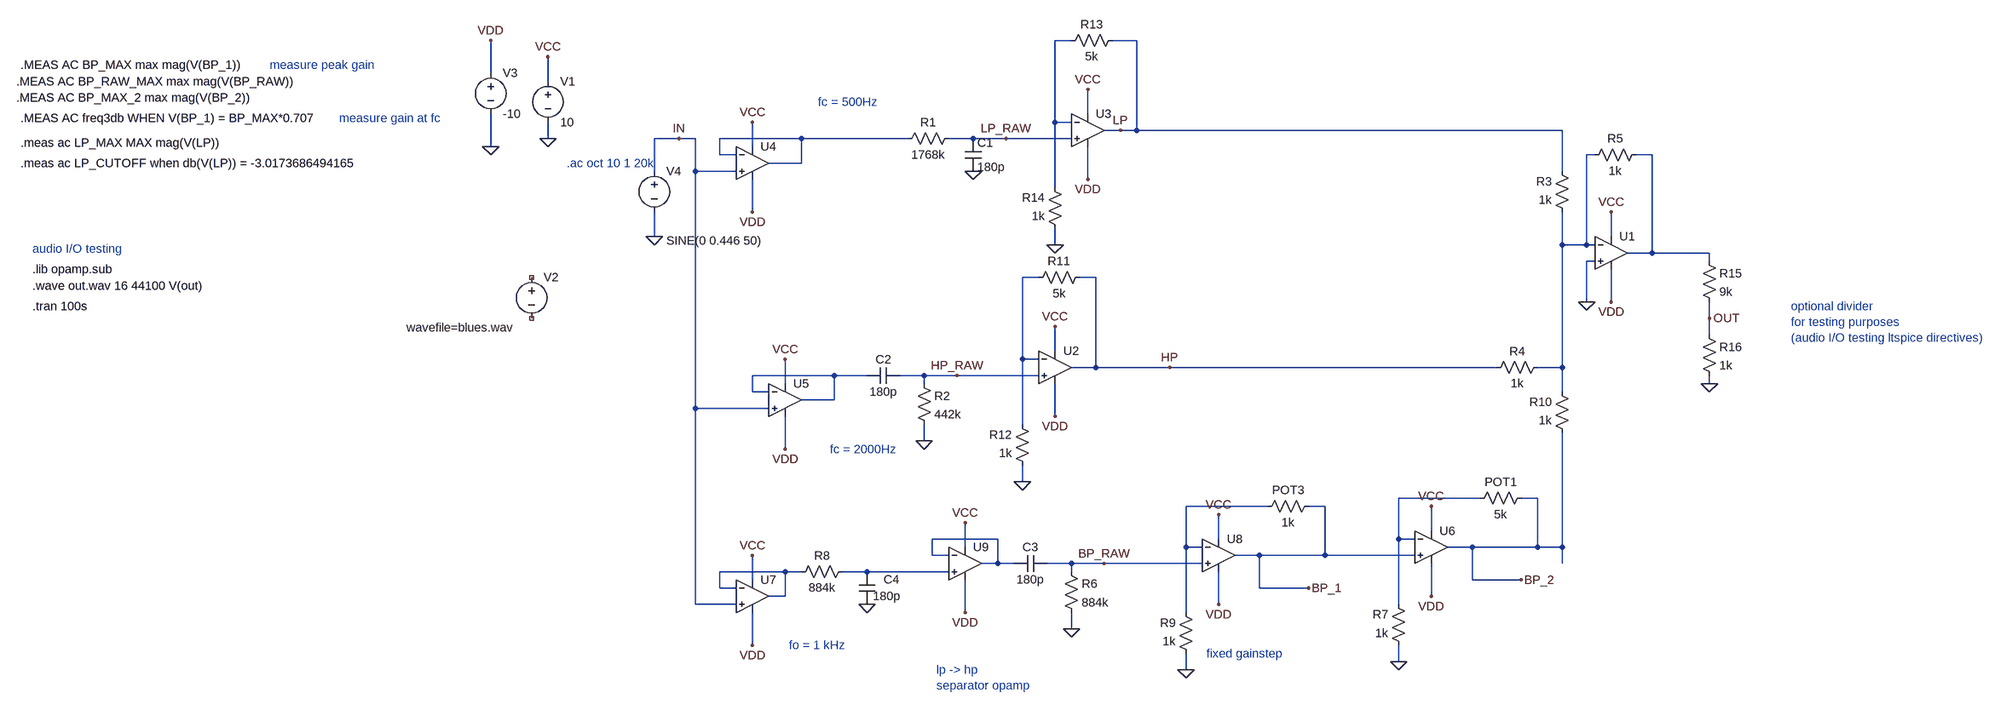
[diagram p0: schematic Draft2.asc]
Draft2.asc, the LTspice schematic file:
Version 4.1
SHEET 1 1964 1344
WIRE 128 -256 96 -256
WIRE 256 -256 208 -256
WIRE -1008 -192 -1008 -256
WIRE -896 -176 -896 -224
WIRE 160 -112 160 -160
WIRE 96 -96 96 -256
WIRE 128 -96 96 -96
WIRE 224 -80 192 -80
WIRE 256 -80 256 -256
WIRE 256 -80 224 -80
WIRE 1088 -80 256 -80
WIRE -896 -64 -896 -96
WIRE -640 -64 -688 -64
WIRE -608 -64 -640 -64
WIRE -400 -64 -560 -64
WIRE -192 -64 -400 -64
WIRE -64 -64 -112 -64
WIRE 0 -64 -64 -64
WIRE 128 -64 0 -64
WIRE -1008 -48 -1008 -112
WIRE -496 -48 -496 -96
WIRE -560 -32 -560 -64
WIRE -528 -32 -560 -32
WIRE 1152 -32 1136 -32
WIRE 1264 -32 1232 -32
WIRE -400 -16 -400 -64
WIRE -400 -16 -464 -16
WIRE -688 0 -688 -64
WIRE -608 0 -608 -64
WIRE -528 0 -608 0
WIRE 1088 0 1088 -80
WIRE 160 16 160 -48
WIRE 96 32 96 -96
WIRE -496 80 -496 16
WIRE -688 128 -688 80
WIRE 1184 128 1184 80
WIRE 96 144 96 112
WIRE 1088 144 1088 80
WIRE 1136 144 1136 -32
WIRE 1136 144 1088 144
WIRE 1152 144 1136 144
WIRE 1264 160 1264 -32
WIRE 1264 160 1216 160
WIRE 1376 160 1264 160
WIRE 1152 176 1136 176
WIRE 1376 176 1376 160
WIRE 64 208 32 208
WIRE 176 208 144 208
WIRE 1136 256 1136 176
WIRE 1184 256 1184 192
WIRE 1376 288 1376 256
WIRE 1376 320 1376 288
WIRE 96 352 96 304
WIRE 32 368 32 208
WIRE 64 368 32 368
WIRE 176 384 176 208
WIRE 176 384 128 384
WIRE 320 384 176 384
WIRE 960 384 320 384
WIRE 1088 384 1088 144
WIRE 1088 384 1040 384
WIRE -336 400 -496 400
WIRE -272 400 -336 400
WIRE -160 400 -208 400
WIRE -96 400 -160 400
WIRE 64 400 -96 400
WIRE -432 416 -432 368
WIRE -160 416 -160 400
WIRE 1376 416 1376 400
WIRE -496 432 -496 400
WIRE -464 432 -496 432
WIRE 1088 432 1088 384
WIRE -336 448 -336 400
WIRE -336 448 -400 448
WIRE -608 464 -608 0
WIRE -464 464 -608 464
WIRE 96 480 96 416
WIRE 32 496 32 368
WIRE -160 528 -160 496
WIRE -432 544 -432 480
WIRE 32 608 32 576
WIRE 928 640 768 640
WIRE 1040 640 1008 640
WIRE 512 656 352 656
WIRE 624 656 592 656
WIRE 832 704 832 656
WIRE -16 720 -144 720
WIRE 416 720 416 672
WIRE 768 720 768 640
WIRE 800 720 768 720
WIRE -80 736 -80 688
WIRE 352 736 352 656
WIRE 384 736 352 736
WIRE 912 736 864 736
WIRE 1040 736 1040 640
WIRE 1040 736 912 736
WIRE 1088 736 1088 512
WIRE 1088 736 1040 736
WIRE -144 752 -144 720
WIRE -112 752 -144 752
WIRE 496 752 448 752
WIRE 624 752 624 656
WIRE 624 752 496 752
WIRE 800 752 624 752
WIRE -16 768 -16 720
WIRE -16 768 -48 768
WIRE 16 768 -16 768
WIRE 128 768 80 768
WIRE 192 768 128 768
WIRE 384 768 192 768
WIRE 1088 768 1088 736
WIRE -432 784 -560 784
WIRE -400 784 -432 784
WIRE -272 784 -320 784
WIRE -112 784 -272 784
WIRE 128 784 128 768
WIRE -496 800 -496 752
WIRE 912 800 912 736
WIRE 1008 800 912 800
WIRE -560 816 -560 784
WIRE -528 816 -560 816
WIRE 496 816 496 752
WIRE 592 816 496 816
WIRE -432 832 -432 784
WIRE -432 832 -464 832
WIRE 832 832 832 768
WIRE -608 848 -608 464
WIRE -528 848 -608 848
WIRE 416 848 416 784
WIRE 768 848 768 720
WIRE -80 864 -80 800
WIRE 352 864 352 736
WIRE 128 896 128 864
WIRE -496 928 -496 864
WIRE 768 960 768 928
WIRE 352 976 352 944
FLAG -160 528 0
FLAG 1136 256 0
FLAG -64 0 0
FLAG -688 128 0
FLAG -896 -64 0
FLAG -896 -224 VCC
FLAG 1184 80 VCC
FLAG -1008 -256 VDD
FLAG -1008 -48 0
FLAG 1184 256 VDD
FLAG 1376 288 OUT
FLAG -640 -64 IN
FLAG -496 -96 VCC
FLAG -496 80 VDD
FLAG -432 368 VCC
FLAG -432 544 VDD
FLAG 128 896 0
FLAG -496 752 VCC
FLAG -496 928 VDD
FLAG -272 848 0
FLAG 592 816 BP_1
FLAG 0 -64 LP_RAW
FLAG -96 400 HP_RAW
FLAG 416 672 VCC
FLAG 416 848 VDD
FLAG 352 976 0
FLAG 192 768 BP_RAW
FLAG -80 688 VCC
FLAG -80 864 VDD
FLAG 96 304 VCC
FLAG 96 480 VDD
FLAG 32 608 0
FLAG 160 -160 VCC
FLAG 160 16 VDD
FLAG 96 144 0
FLAG 224 -80 LP
FLAG 1008 800 BP_2
FLAG 832 656 VCC
FLAG 832 832 VDD
FLAG 768 960 0
FLAG 1376 416 0
FLAG 320 384 HP
SYMBOL OpAmps\\UniversalOpAmp 1184 160 R0
SYMATTR InstName U1
SYMBOL res -96 -80 R90
WINDOW 0 0 56 VBottom 2
WINDOW 3 32 56 VTop 2
SYMATTR InstName R1
SYMATTR Value 1768k
SYMBOL cap -80 -64 R0
SYMATTR InstName C1
SYMATTR Value 180p
SYMBOL res -176 400 R0
SYMATTR InstName R2
SYMATTR Value 442k
SYMBOL cap -208 384 R90
WINDOW 0 0 32 VBottom 2
WINDOW 3 32 32 VTop 2
SYMATTR InstName C2
SYMATTR Value 180p
SYMBOL voltage -896 -192 R0
WINDOW 123 0 0 Left 0
WINDOW 39 0 0 Left 0
SYMATTR InstName V1
SYMATTR Value 10
SYMBOL voltage -1008 -208 R0
WINDOW 123 0 0 Left 0
WINDOW 39 0 0 Left 0
SYMATTR InstName V3
SYMATTR Value -10
SYMBOL voltage -928 192 R0
WINDOW 123 -245 114 Left 2
WINDOW 39 0 0 Left 0
SYMATTR Value2 wavefile=blues.wav
SYMATTR InstName V2
SYMATTR Value ""
SYMBOL res 1104 96 R180
WINDOW 0 36 76 Left 2
WINDOW 3 36 40 Left 2
SYMATTR InstName R3
SYMATTR Value 1k
SYMBOL res 1056 368 R90
WINDOW 0 0 56 VBottom 2
WINDOW 3 32 56 VTop 2
SYMATTR InstName R4
SYMATTR Value 1k
SYMBOL res 1248 -48 R90
WINDOW 0 0 56 VBottom 2
WINDOW 3 32 56 VTop 2
SYMATTR InstName R5
SYMATTR Value 1k
SYMBOL OpAmps\\UniversalOpAmp -496 -16 R0
SYMATTR InstName U4
SYMBOL OpAmps\\UniversalOpAmp -432 448 R0
SYMATTR InstName U5
SYMBOL res 112 768 R0
SYMATTR InstName R6
SYMATTR Value 884k
SYMBOL cap 80 752 R90
WINDOW 0 0 32 VBottom 2
WINDOW 3 32 32 VTop 2
SYMATTR InstName C3
SYMATTR Value 180p
SYMBOL OpAmps\\UniversalOpAmp -496 832 R0
SYMATTR InstName U7
SYMBOL res -304 768 R90
WINDOW 0 0 56 VBottom 2
WINDOW 3 32 56 VTop 2
SYMATTR InstName R8
SYMATTR Value 884k
SYMBOL cap -288 784 R0
WINDOW 0 49 15 Left 2
WINDOW 3 28 48 Left 2
SYMATTR InstName C4
SYMATTR Value 180p
SYMBOL res 1104 528 R180
WINDOW 0 36 76 Left 2
WINDOW 3 36 40 Left 2
SYMATTR InstName R10
SYMATTR Value 1k
SYMBOL OpAmps\\UniversalOpAmp 416 752 R0
SYMATTR InstName U8
SYMBOL res 368 960 R180
WINDOW 0 36 76 Left 2
WINDOW 3 36 40 Left 2
SYMATTR InstName R9
SYMATTR Value 1k
SYMBOL OpAmps\\UniversalOpAmp -80 768 R0
SYMATTR InstName U9
SYMBOL res 608 640 R90
WINDOW 0 0 56 VBottom 2
WINDOW 3 32 56 VTop 2
SYMATTR InstName POT3
SYMATTR Value 1k
SYMBOL OpAmps\\UniversalOpAmp 96 384 R0
SYMATTR InstName U2
SYMBOL res 160 192 R90
WINDOW 0 0 56 VBottom 2
WINDOW 3 32 56 VTop 2
SYMATTR InstName R11
SYMATTR Value 5k
SYMBOL res 48 592 R180
WINDOW 0 36 76 Left 2
WINDOW 3 36 40 Left 2
SYMATTR InstName R12
SYMATTR Value 1k
SYMBOL OpAmps\\UniversalOpAmp 160 -80 R0
SYMATTR InstName U3
SYMBOL res 224 -272 R90
WINDOW 0 0 56 VBottom 2
WINDOW 3 32 56 VTop 2
SYMATTR InstName R13
SYMATTR Value 5k
SYMBOL res 112 128 R180
WINDOW 0 36 76 Left 2
WINDOW 3 36 40 Left 2
SYMATTR InstName R14
SYMATTR Value 1k
SYMBOL OpAmps\\UniversalOpAmp 832 736 R0
SYMATTR InstName U6
SYMBOL res 784 944 R180
WINDOW 0 36 76 Left 2
WINDOW 3 36 40 Left 2
SYMATTR InstName R7
SYMATTR Value 1k
SYMBOL res 1024 624 R90
WINDOW 0 0 56 VBottom 2
WINDOW 3 32 56 VTop 2
SYMATTR InstName POT1
SYMATTR Value 5k
SYMBOL res 1360 160 R0
SYMATTR InstName R15
SYMATTR Value 9k
SYMBOL res 1360 304 R0
SYMATTR InstName R16
SYMATTR Value 1k
SYMBOL voltage -688 -16 R0
WINDOW 3 24 152 Left 2
WINDOW 123 24 124 Left 2
WINDOW 39 0 0 Left 0
SYMATTR InstName V4
SYMATTR Value SINE(0 0.446 50)
TEXT -688 -16 Right 2 ;.ac oct 10 1 20k
TEXT -1928 -208 Left 2 !.MEAS AC BP_MAX max mag(V(BP_1))
TEXT -1928 -104 Left 2 !.MEAS AC freq3db WHEN V(BP_1) = BP_MAX*0.707
TEXT -1928 -16 Left 2 !.meas ac LP_CUTOFF when db(V(LP)) = -3.0173686494165
TEXT -1928 -56 Left 2 !.meas ac LP_MAX MAX mag(V(LP))
TEXT -368 -136 Left 2 ;fc = 500Hz
TEXT -344 544 Left 2 ;fc = 2000Hz
TEXT -424 928 Left 2 ;fo = 1 kHz
TEXT -1936 -176 Left 2 !.MEAS AC BP_RAW_MAX max mag(V(BP_RAW))
TEXT -1936 -144 Left 2 !.MEAS AC BP_MAX_2 max mag(V(BP_2))
TEXT -1904 224 Left 2 !.wave out.wav 16 44100 V(out)
TEXT -1904 264 Left 2 !.tran 100s
TEXT -1904 192 Left 2 !.lib opamp.sub
TEXT -136 976 Left 2 ;lp -> hp\nseparator opamp
TEXT 392 944 Left 2 ;fixed gainstep
TEXT 1536 264 Left 2 ;optional divider\nfor testing purposes\n(audio I/O testing ltspice directives)
TEXT -1440 -208 Left 2 ;measure peak gain
TEXT -1304 -104 Left 2 ;measure gain at fc
TEXT -1904 152 Left 2 ;audio I/O testing

The netlist it stands for:
* Draft2.asc
X§U1 0 N003 VCC VDD N004 level1 Avol=1Meg GBW=10Meg Vos=0 En=0 Enk=0 In=0 Ink=0 Rin=500Meg  ; pins In+ In- V+ V- OUT
R1 LP_RAW N002 1768k
C1 LP_RAW 0 180p
R2 HP_RAW 0 442k
C2 HP_RAW N006 180p
V1 VCC 0 10
V3 VDD 0 -10
V2 NC_01 NC_02 wavefile=blues.wav
R3 N003 LP 1k
R4 N003 HP 1k
R5 N004 N003 1k
X§U4 IN N002 VCC VDD N002 level1 Avol=1Meg GBW=10Meg Vos=0 En=0 Enk=0 In=0 Ink=0 Rin=500Meg  ; pins In+ In- V+ V- OUT
X§U5 IN N006 VCC VDD N006 level1 Avol=1Meg GBW=10Meg Vos=0 En=0 Enk=0 In=0 Ink=0 Rin=500Meg  ; pins In+ In- V+ V- OUT
R6 BP_RAW 0 884k
C3 BP_RAW N009 180p
X§U7 IN N010 VCC VDD N010 level1 Avol=1Meg GBW=10Meg Vos=0 En=0 Enk=0 In=0 Ink=0 Rin=500Meg  ; pins In+ In- V+ V- OUT
R8 N011 N010 884k
C4 N011 0 180p
R10 BP_2 N003 1k
X§U8 BP_RAW N008 VCC VDD BP_1 level1 Avol=1Meg GBW=10Meg Vos=0 En=0 Enk=0 In=0 Ink=0 Rin=500Meg  ; pins In+ In- V+ V- OUT
R9 0 N008 1k
X§U9 N011 N009 VCC VDD N009 level1 Avol=1Meg GBW=10Meg Vos=0 En=0 Enk=0 In=0 Ink=0 Rin=500Meg  ; pins In+ In- V+ V- OUT
R§POT3 BP_1 N008 1k
X§U2 HP_RAW N005 VCC VDD HP level1 Avol=1Meg GBW=10Meg Vos=0 En=0 Enk=0 In=0 Ink=0 Rin=500Meg  ; pins In+ In- V+ V- OUT
R11 HP N005 5k
R12 0 N005 1k
X§U3 LP_RAW N001 VCC VDD LP level1 Avol=1Meg GBW=10Meg Vos=0 En=0 Enk=0 In=0 Ink=0 Rin=500Meg  ; pins In+ In- V+ V- OUT
R13 LP N001 5k
R14 0 N001 1k
X§U6 BP_1 N007 VCC VDD BP_2 level1 Avol=1Meg GBW=10Meg Vos=0 En=0 Enk=0 In=0 Ink=0 Rin=500Meg  ; pins In+ In- V+ V- OUT
R7 0 N007 1k
R§POT1 BP_2 N007 5k
R15 N004 OUT 9k
R16 OUT 0 1k
V4 IN 0 SINE(0 0.446 50)
* .ac oct 10 1 20k
.MEAS AC BP_MAX max mag(V(BP_1))
.MEAS AC freq3db WHEN V(BP_1) = BP_MAX*0.707
.meas ac LP_CUTOFF when db(V(LP)) = -3.0173686494165
.meas ac LP_MAX MAX mag(V(LP))
* fc = 500Hz
* fc = 2000Hz
* fo = 1 kHz
.MEAS AC BP_RAW_MAX max mag(V(BP_RAW))
.MEAS AC BP_MAX_2 max mag(V(BP_2))
.wave out.wav 16 44100 V(out)
.tran 100s
.lib opamp.sub
* lp -> hp
* separator opamp
* fixed gainstep
* optional divider
* for testing purposes
* (audio I/O testing ltspice directives)
* measure peak gain
* measure gain at fc
* audio I/O testing
.lib UniversalOpAmp1.lib
.backanno
.end